# Altium project POWER_PCB.PrjPcb
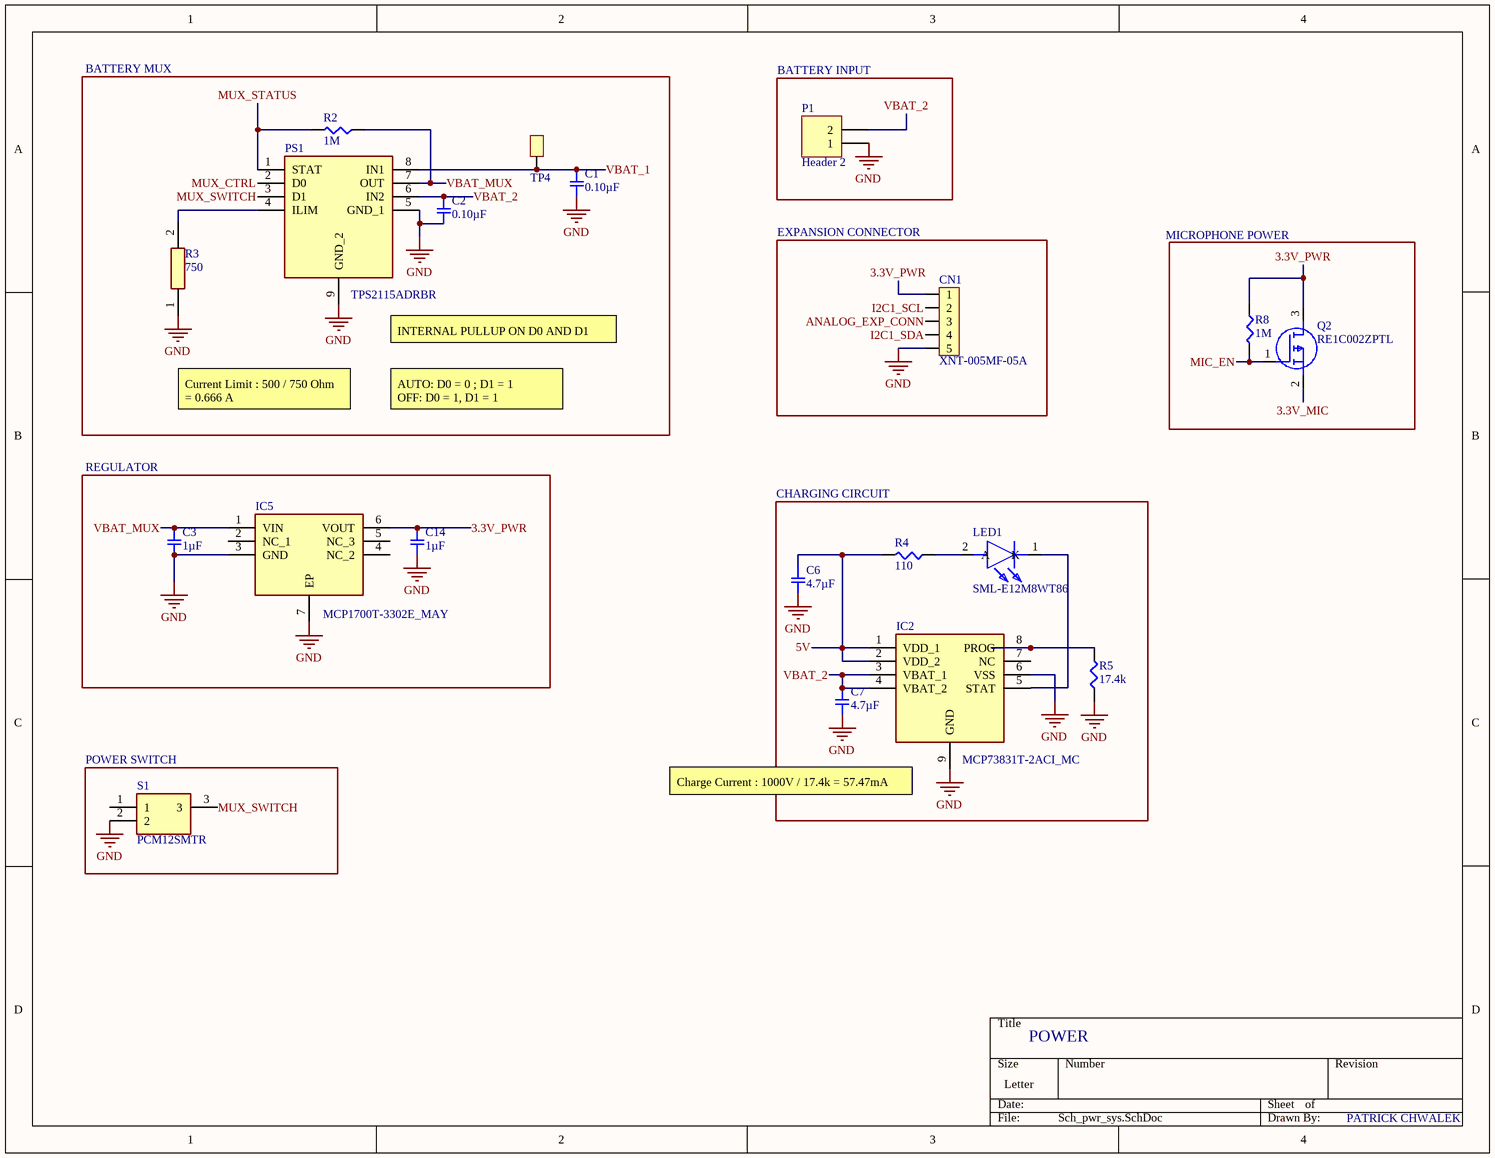
[diagram p0: Sch_pwr_sys.SchDoc]
3 sheets, 88 parts. Net scope: global (net labels, ports and power ports of the same name join across sheets).
Board file: POWER_PCB_v2.PcbDoc
Sheets:
  Sch_pwr_sys.SchDoc
  sch_sensors.SchDoc
  Sch_MCU.SchDoc

## Sheet Sch_pwr_sys.SchDoc
size Letter

### Parts
C1  0.10µF  [SMD-0402C]
C2  0.10µF  [SMD-0402C]
C3  1µF  [SMD-0402C]
C6  4.7µF  [SMD-0402C]
C7  4.7µF  [SMD-0402C]
C14  1µF  [SMD-0402C]
CN1  XNT-005MF-05A  [XNT-005MF-05A]
IC2  MCP73831T-2ACI_MC  [SON50P300X200X100-9N-D]
IC5  MCP1700T-3302E_MAY  [SON65P200X200X90-7N]
LED1  SML-E12M8WT86  [LEDC1608X46N]
P1  Header 2  [HDR1X2]
PS1  TPS2115ADRBR  [SON65P300X300X100-9N-D]
Q2  RE1C002ZPTL  [SOTFL50P160X85-3N]
R2  1M  [SMD-0402-RES]
R3  750  [RESC1005X40N]
R4  110  [SMD-0402-RES]
R5  17.4k  [SMD-0402-RES]
R8  1M  [SMD-0402-RES]
S1  PCM12SMTR  [PCM12SMTR_1]
TP4  TestPoint  [TestPoint_0.4mm]  (value not drawn)

### Blocks framed on the sheet
BATTERY MUX: C1 C2 PS1 R2 R3 TP4
BATTERY INPUT: P1
EXPANSION CONNECTOR: CN1
REGULATOR: C3 C14 IC5
CHARGING CIRCUIT: C6 C7 IC2 LED1 R4 R5
POWER SWITCH: S1

### Nets
3.3V_PWR: C14.1 CN1.1 IC5.6(VOUT) Q2.3(D) R8.1
GND: C1.2 C2.2 C3.2 C6.2 C7.2 C14.2 CN1.5 IC2.6(VSS) IC2.9(GND) IC5.3(GND) IC5.7(EP) P1.1 PS1.5(GND_1) PS1.9(GND_2) R3.1 R5.1 S1.2
3.3V_MIC: Q2.2(S)
5V: C6.1 IC2.1(VDD_1) IC2.2(VDD_2) R4.2
ANALOG_EXP_CONN: CN1.3
I2C1_SCL: CN1.2
I2C1_SDA: CN1.4
MIC_EN: Q2.1(G) R8.2
MUX_CTRL: PS1.2(D0)
MUX_STATUS: PS1.1(STAT) R2.2
MUX_SWITCH: PS1.3(D1) S1.3
VBAT_1: C1.1 PS1.8(IN1) TP4.1
VBAT_2: C2.1 C7.1 IC2.3(VBAT_1) IC2.4(VBAT_2) P1.2 PS1.6(IN2)
VBAT_MUX: C3.1 IC5.1(VIN) PS1.7(OUT) R2.1
NetIC2_5: IC2.5(STAT) LED1.1(K)
NetIC2_8: IC2.8(PROG) R5.2
NetLED1_2: LED1.2(A) R4.1
NetPS1_4: PS1.4(ILIM) R3.2

Not connected (* = marked no-connect by the designer): IC2 7(NC); IC5 2(NC_1) 4(NC_2) 5(NC_3); S1 1

### Notes on the sheet
- MICROPHONE POWER
- (near PS1) INTERNAL PULLUP ON D0 AND D1
- Current Limit : 500 / 750 Ohm = 0.666 A
- AUTO: D0 = 0 ; D1 = 1
  OFF: D0 = 1, D1 = 1
- (near IC2) Charge Current : 1000V / 17.4k = 57.47mA
- POWER
- PATRICK CHWALEK

### Library data of the parts
C1 C2 = GCM155R71C104KA55D: CAP CER 0.1UF 16V X7R 0402; Manufacturer: Murata Electronics North America; Factory Stock: 0; Unit Price (USD): 0.1; Minimum Quantity: 1; Tolerance: ±10%; Datasheets: http://www.murata.com/~/media/webrenewal/support/library/catalog/products/capacitor/mlcc/c03e.ashx; Image: //media.digikey.com/Renders/Murata%20Renders/ZRB-SERIES-0402.jpg; Digi-Key Part Number: 490-4759-1-ND; Part Number: GCM155R71C104KA55D; Quantity Available: 734194; @ qty: 0; Packaging: Cut Tape (CT); Series: GCM; Part Status: Active; Value: 0.10µF; Voltage: 16V; Temperature Coefficient: X7R; Operating Temperature: -55°C ~ 125°C; Features: -; Ratings: AEC-Q200; Applications: Automotive; Mounting Type: Surface Mount, MLCC; Package / Case: 0402 (1005 Metric); Size / Dimension: 0.039" L x 0.020" W (1.00mm x 0.50mm); Height - Seated (Max): -; Thickness (Max): 0.022" (0.55mm); Lead Spacing: -; Lead Style: -
C3 C14 = GCM155C71A105KE38D: CAP CER 1UF 10V X7S 0402; Manufacturer: Murata Electronics North America; Factory Stock: 0; Unit Price (USD): 0.12; Minimum Quantity: 1; Tolerance: ±10%; Datasheets: http://www.murata.com/~/media/webrenewal/support/library/catalog/products/capacitor/mlcc/c03e.ashx; Image: //media.digikey.com/Renders/Murata%20Renders/ZRB-SERIES-0402.jpg; Digi-Key Part Number: 490-13409-1-ND; Part Number: GCM155C71A105KE38D; Quantity Available: 7240; @ qty: 0; Packaging: Cut Tape (CT); Series: GCM; Part Status: Active; Value: 1µF; Voltage: 10V; Temperature Coefficient: X7S; Operating Temperature: -55°C ~ 125°C; Features: -; Ratings: AEC-Q200; Applications: Automotive; Mounting Type: Surface Mount, MLCC; Package / Case: 0402 (1005 Metric); Size / Dimension: 0.039" L x 0.020" W (1.00mm x 0.50mm); Height - Seated (Max): -; Thickness (Max): 0.022" (0.55mm); Lead Spacing: -; Lead Style: -
C6 C7 = GRM153R60G475ME15D: CAP CER 4.7UF 4V X5R 0402; Manufacturer: Murata Electronics North America; Factory Stock: 0; Unit Price (USD): 0.27; Minimum Quantity: 1; Tolerance: ±20%; Datasheets: http://psearch.en.murata.com/capacitor/product/GRM153R60G475ME15%23.pdf; Image: //media.digikey.com/Renders/Murata%20Renders/ZRB-SERIES-0402.jpg; Digi-Key Part Number: 490-13231-1-ND; Part Number: GRM153R60G475ME15D; Quantity Available: 9100; @ qty: 0; Packaging: Cut Tape (CT); Series: GRM; Part Status: Active; Value: 4.7µF; Voltage: 4V; Temperature Coefficient: X5R; Operating Temperature: -55°C ~ 85°C; Features: -; Ratings: -; Applications: General Purpose; Mounting Type: Surface Mount, MLCC; Package / Case: 0402 (1005 Metric); Size / Dimension: 0.039" L x 0.020" W (1.00mm x 0.50mm); Height - Seated (Max): -; Thickness (Max): 0.013" (0.33mm); Lead Spacing: -; Lead Style: -
IC2 = MCP73831T-2ACI_MC: Integrated Circuit; Manufacturer_Name: Microchip; Manufacturer_Part_Number: MCP73831T-2ACI/MC; Allied_Number: 70452042; Datasheet Link: http://ww1.microchip.com/downloads/en/DeviceDoc/20001984g.pdf; Height: 1mm; Mouser Part Number: 579-MCP73831T-2ACIMC; Mouser Price/Stock: https://www.mouser.com/Search/Refine.aspx?Keyword=579-MCP73831T-2ACIMC; Allied Price/Stock: https://www.alliedelec.com/microchiptechnologyinc-mcp73831t-2aci-mc/70452042/
IC5 = MCP1700T-3302E_MAY: Integrated Circuit; Manufacturer_Name: Microchip; Manufacturer_Part_Number: MCP1700T-3302E/MAY; Allied_Number: 70567878; Datasheet Link: http://ww1.microchip.com/downloads/en/DeviceDoc/20001826D.pdf; Height: 0.9mm; Mouser Part Number: 579-MCP1700T3302EMAY; Mouser Price/Stock: https://www.mouser.com/Search/Refine.aspx?Keyword=579-MCP1700T3302EMAY; Allied Price/Stock: https://www.alliedelec.com/microchip-technology-inc-mcp1700t-3302e-may/70567878/
LED1 = SML-E12M8WT86: LED; Manufacturer_Name: ROHM Semiconductor; Datasheet Link: https://www.rohm.com/datasheet/SML-E12M8W/sml-e1-e; Height: 0.46mm; Manufacturer_Part_Number: SML-E12M8WT86; Mouser Part Number: 755-SML-E12M8WT86; Mouser Price/Stock: https://www.mouser.com/Search/Refine.aspx?Keyword=755-SML-E12M8WT86; RS Part Number: 6942799; RS Price/Stock: http://uk.rs-online.com/web/p/products/6942799
P1 = Header 2: Header, 2-Pin; LatestRevisionDate: 17-Jul-2002; LatestRevisionNote: Re-released for DXP Platform.; Publisher: Altium Limited
PS1 = TPS2115ADRBR: Power Supply; Manufacturer_Name: Texas Instruments; Datasheet Link: http://www.ti.com/lit/gpn/tps2115a; Height: 1mm; Manufacturer_Part_Number: TPS2115ADRBR; Mouser Part Number: 595-TPS2115ADRBR; Mouser Price/Stock: https://www.mouser.com/Search/Refine.aspx?Keyword=595-TPS2115ADRBR
Q2 = RE1C002ZPTL: MOSFET (P-Channel); Manufacturer_Name: ROHM Semiconductor; Datasheet Link: https://componentsearchengine.com/Datasheets/1/RE1C002ZPTL.pdf; Height: 0.85mm; Manufacturer_Part_Number: RE1C002ZPTL; Mouser Part Number: 755-RE1C002ZPTL; Mouser Price/Stock: https://www.mouser.com/Search/Refine.aspx?Keyword=755-RE1C002ZPTL; RS Part Number: 1486960P; RS Price/Stock: http://uk.rs-online.com/web/p/products/1486960P
R2 R8 = ERJ-2GEJ105X: RES SMD 1M OHM 5% 1/10W 0402; Manufacturer: Panasonic Electronic Components; Factory Stock: 0; Unit Price (USD): 0.00350; @ qty: 1500; Minimum Quantity: 1; Power (Watts): 0.1W, 1/10W; Temperature Coefficient: ±200ppm/°C; Part Number: ERJ-2GEJ105X; Datasheets: http://industrial.panasonic.com/www-cgi/jvcr13pz.cgi?E+PZ+3+AOA0001+ERJ2GEJ105X+7+WW; Image: //media.digikey.com/Photos/Panasonic%20Photos/ERJ-PA2-Series.jpg; Digi-Key Part Number: P1.0MJCT-ND; Quantity Available: 1082572; Packaging: Cut Tape (CT); Series: ERJ; Part Status: Active; Value: 1M; Tolerance: ±5%; Composition: Thick Film; Features: Automotive AEC-Q200; Operating Temperature: -55°C ~ 155°C; Package / Case: 0402 (1005 Metric); Supplier Device Package: 0402; Size / Dimension: 0.039" L x 0.020" W (1.00mm x 0.50mm); Height - Seated (Max): 0.016" (0.40mm); Number of Terminations: 2; Failure Rate: -
R3 = ERJ-2RKF7500X: RES SMD 750 OHM 1% 1/10W 0402; Manufacturer_Name: Panasonic; Allied_Number: 70265602; Datasheet Link: https://industrial.panasonic.com/cdbs/www-data/pdf/RDA0000/AOA0000C86.pdf; Height: 0.4mm; Manufacturer_Part_Number: ERJ-2RKF7500X; Mouser Part Number: 667-ERJ-2RKF7500X; Allied Price/Stock: https://www.alliedelec.com/panasonic-erj-2rkf7500x/70265602/; Value: 750
R4 = ERJ-2RKF8062X: RES SMD 110 OHM 5% 1/10W 0402; Manufacturer: Panasonic Electronic Components; Factory Stock: 0; Unit Price (USD): 0.00496; @ qty: 1500; Minimum Quantity: 1; Power (Watts): 0.1W, 1/10W; Temperature Coefficient: ±100ppm/°C; Part Number: ERJ-2RKF8062X; Datasheets: http://industrial.panasonic.com/www-cgi/jvcr13pz.cgi?E+PZ+3+AOA0002+ERJ2RKF8062X+7+WW; Image: //media.digikey.com/Photos/Panasonic%20Photos/ERJ-PA2-Series.jpg; Digi-Key Part Number: P80.6KLCT-ND; Quantity Available: 91747; Packaging: Cut Tape (CT); Series: ERJ; Part Status: Active; Value: 110; Tolerance: ±5%; Composition: Thick Film; Features: Automotive AEC-Q200; Operating Temperature: -55°C ~ 155°C; Package / Case: 0402 (1005 Metric); Supplier Device Package: 0402; Size / Dimension: 0.039" L x 0.020" W (1.00mm x 0.50mm); Height - Seated (Max): 0.016" (0.40mm); Number of Terminations: 2; Failure Rate: -
R5 = ERJ-2GEJ103X: RES SMD 17.4K OHM 1% 1/10W 0402; Manufacturer: Panasonic Electronic Components; Factory Stock: 0; Unit Price (USD): 0.00350; @ qty: 1500; Minimum Quantity: 1; Power (Watts): 0.1W, 1/10W; Temperature Coefficient: ±200ppm/°C; Part Number: ERJ-2GEJ103X; Datasheets: http://industrial.panasonic.com/www-cgi/jvcr13pz.cgi?E+PZ+3+AOA0001+ERJ2GEJ103X+7+WW; Image: //media.digikey.com/Photos/Panasonic%20Photos/ERJ-PA2-Series.jpg; Digi-Key Part Number: P10KJCT-ND; Quantity Available: 2560215; Packaging: Cut Tape (CT); Series: ERJ; Part Status: Active; Value: 17.4k; Tolerance: ±1%; Composition: Thick Film; Features: Automotive AEC-Q200; Operating Temperature: -55°C ~ 155°C; Package / Case: 0402 (1005 Metric); Supplier Device Package: 0402; Size / Dimension: 0.039" L x 0.020" W (1.00mm x 0.50mm); Height - Seated (Max): 0.016" (0.40mm); Number of Terminations: 2; Failure Rate: -
S1 = PCM12SMTR: Switch; Manufacturer_Name: C & K COMPONENTS; Allied_Number: 70417448; Datasheet Link: http://www.farnell.com/datasheets/1789487.pdf; Manufacturer_Part_Number: PCM12SMTR; Mouser Part Number: 611-PCM12SMTR; Mouser Price/Stock: https://www.mouser.com/Search/Refine.aspx?Keyword=611-PCM12SMTR; RS Part Number: 7931721P; RS Price/Stock: http://uk.rs-online.com/web/p/products/7931721P; Allied Price/Stock: https://www.alliedelec.com/c-k-pcm12smtr/70417448/

## Sheet sch_sensors.SchDoc
size Letter
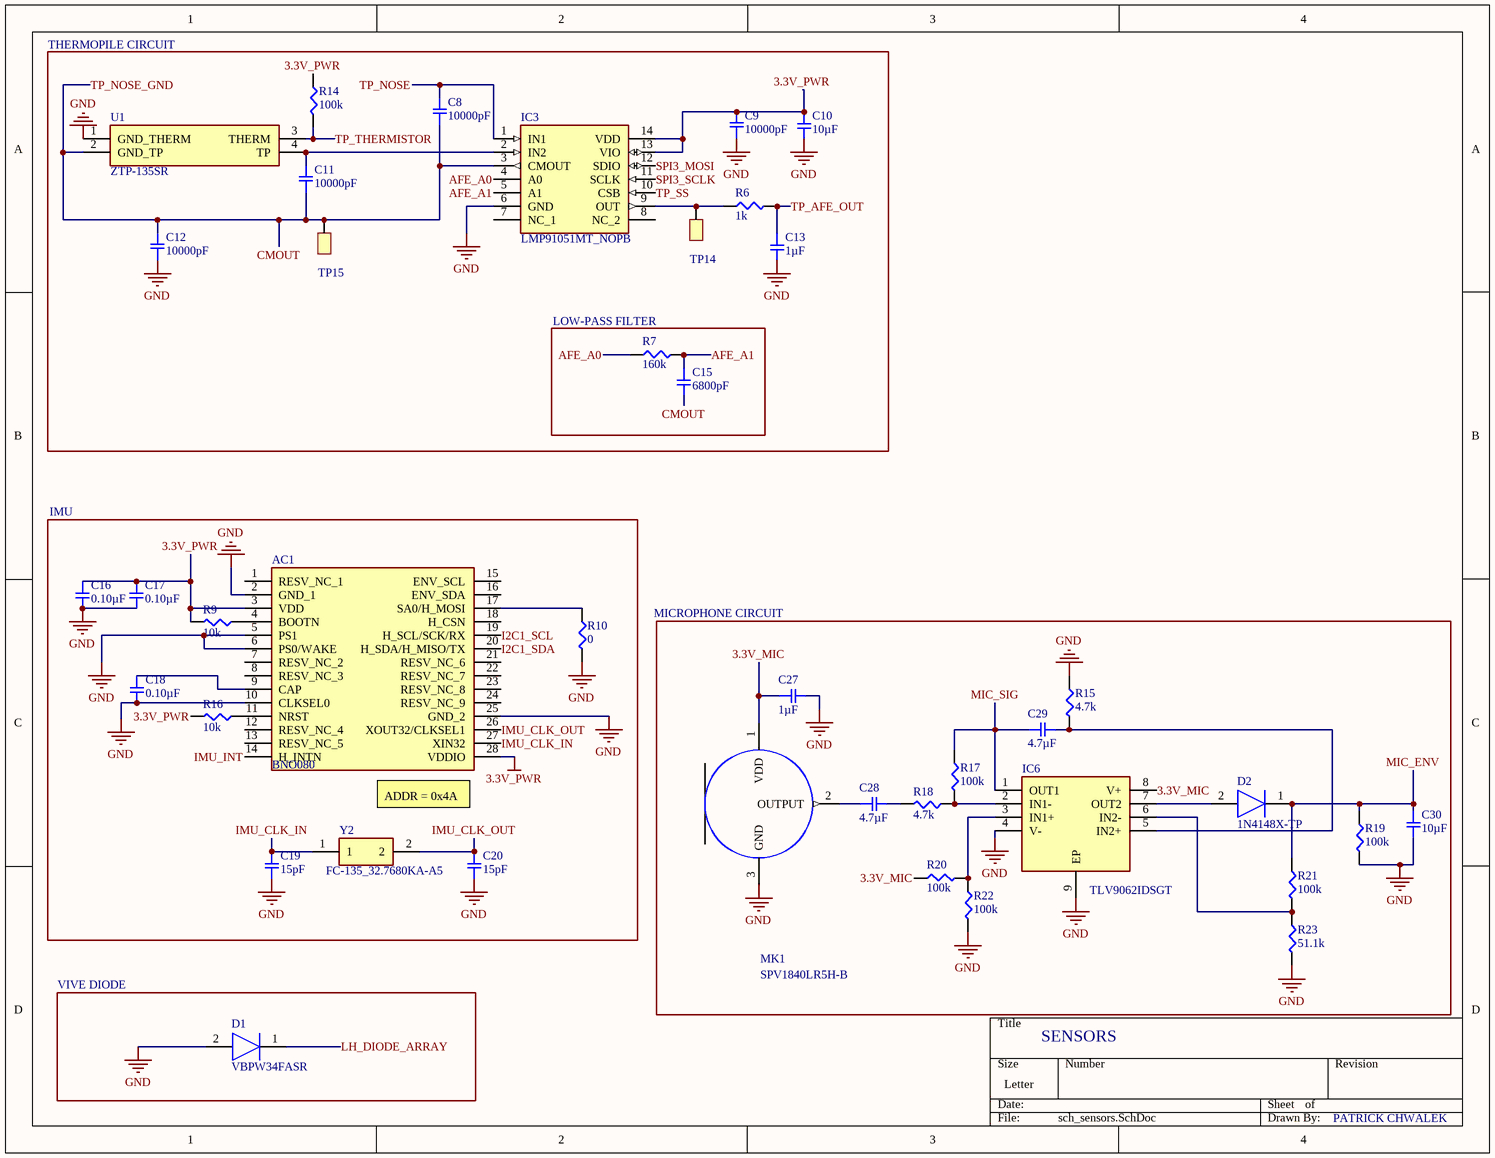
[diagram p1: sch_sensors.SchDoc]

### Parts
AC1  BNO080  [BNO080]
C8  10000pF  [SMD-0402C]
C9  10000pF  [SMD-0402C]
C10  10µF  [SMD-0402C]
C11  10000pF  [SMD-0402C]
C12  10000pF  [SMD-0402C]
C13  1µF  [SMD-0402C]
C15  6800pF  [SMD-0402C]
C16  0.10µF  [CAPC1005X55N]
C17  0.10µF  [CAPC1005X55N]
C18  0.10µF  [CAPC1005X55N]
C19  15pF  [CAPC1005X55N]
C20  15pF  [CAPC1005X55N]
C27  1µF  [SMD-0402-RES]
C28  4.7µF  [SMD-0402C]
C29  4.7µF  [SMD-0402C]
C30  10µF  [SMD-0402C]
D1  VBPW34FASR  [VBPW34FASR]
D2  1N4148X-TP  [SODFL1608X70N]
IC3  LMP91051MT_NOPB  [SOP65P640X120-14N]
IC6  TLV9062IDSGT  [SON50P200X200X80-9N]
MK1  SPV1840LR5H-B  [*MIC_SPV1840LR5H-B]
R6  1k  [SMD-0402-RES]
R7  160k  [SMD-0402-RES]
R9  10k  [SMD-0402-RES]
R10  0  [SMD-0402-RES]
R14  100k  [SMD-0402-RES]
R15  4.7k  [SMD-0402-RES]
R16  10k  [SMD-0402-RES]
R17  100k  [SMD-0402-RES]
R18  4.7k  [SMD-0402-RES]
R19  100k  [SMD-0402-RES]
R20  100k  [SMD-0402-RES]
R21  100k  [SMD-0402-RES]
R22  100k  [SMD-0402-RES]
R23  51.1k  [SMD-0402-RES]
TP14  TestPoint  [TestPoint_0.4mm]  (value not drawn)
TP15  TestPoint  [TestPoint_0.4mm]  (value not drawn)
U1  ZTP-135SR  [ZTP-135SR]
Y2  FC-135_32.7680KA-A5  [FC135327680KAAG0]

### Blocks framed on the sheet
THERMOPILE CIRCUIT: C8-C13 IC3 R6 R14 TP14 TP15 U1
LOW-PASS FILTER: C15 R7
IMU: AC1 C16-C20 R9 R10 R16 Y2
VIVE DIODE: D1

### Nets
3.3V_PWR: AC1.3(VDD) AC1.28(VDDIO) C9.2 C10.1 C16.1 C17.1 IC3.13(VIO) IC3.14(VDD) R9.2 R14.1 R16.2
GND: AC1.2(GND_1) AC1.5(PS1) AC1.6(PS0/WAKE) AC1.10(CLKSEL0) AC1.25(GND_2) C9.1 C10.2 C12.1 C13.2 C16.2 C17.2 C18.2 C19.2 C20.2 C27.2 C30.2 D1.2(K) IC3.6(GND) IC6.4(V-) IC6.9(EP) MK1.3(GND) R10.2 R15.1 R19.2 R22.2 R23.2 U1.1(GND_THERM)
3.3V_MIC: C27.1 IC6.8(V+) MK1.1(VDD) R20.1
AFE_A0: IC3.4(A0) R7.1
AFE_A1: C15.1 IC3.5(A1) R7.2
CMOUT: C8.1 C11.1 C12.2 C15.2 IC3.3(CMOUT) TP15.1 U1.2(GND_TP)  [also labelled TP_NOSE_GND]
I2C1_SCL: AC1.19(H_SCL/SCK/RX)
I2C1_SDA: AC1.20(H_SDA/H_MISO/TX)
IMU_CLK_IN: AC1.27(XIN32) C19.1 Y2.1
IMU_CLK_OUT: AC1.26(XOUT32/CLKSEL1) C20.1 Y2.2
IMU_INT: AC1.14(H_INTN)
LH_DIODE_ARRAY: D1.1(A)
MIC_ENV: C30.1 D2.1(K) R19.1 R21.1
MIC_SIG: C29.1 IC6.1(OUT1) R17.1
SPI3_MOSI: IC3.12(SDIO)
SPI3_SCLK: IC3.11(SCLK)
TP_AFE_OUT: C13.1 R6.2
TP_NOSE: C8.2 IC3.1(IN1)
TP_SS: IC3.10(CSB)
TP_THERMISTOR: R14.2 U1.3(THERM)
NetAC1_4: AC1.4(BOOTN) R9.1
NetAC1_9: AC1.9(CAP) C18.1
NetAC1_11: AC1.11(NRST) R16.1
NetAC1_17: AC1.17(SA0/H_MOSI) R10.1
NetC11_2: C11.2 IC3.2(IN2) U1.4(TP)
NetC28_1: C28.1 MK1.2(OUTPUT)
NetC28_2: C28.2 R18.2
NetC29_2: C29.2 IC6.5(IN2+) R15.2
NetD2_2: D2.2(A) IC6.7(OUT2)
NetIC3_9: IC3.9(OUT) R6.1 TP14.1
NetIC6_2: IC6.2(IN1-) R17.2 R18.1
NetIC6_3: IC6.3(IN1+) R20.2 R22.1
NetIC6_6: IC6.6(IN2-) R21.2 R23.1

Not connected (* = marked no-connect by the designer): AC1 1(RESV_NC_1) 7(RESV_NC_2) 8(RESV_NC_3) 12(RESV_NC_4) 13(RESV_NC_5) 15(ENV_SCL) 16(ENV_SDA) 18(H_CSN) 21(RESV_NC_6) 22(RESV_NC_7) 23(RESV_NC_8) 24(RESV_NC_9); IC3 7(NC_1) 8(NC_2)

### Notes on the sheet
- MICROPHONE CIRCUIT
- (near AC1) ADDR = 0x4A
- SENSORS
- PATRICK CHWALEK

### Library data of the parts
AC1 = BNO080: Accelerometer; Manufacturer_Name: Hillcrest Laboratories; Datasheet Link: http://www.hillcrestlabs.com/download/5a05f340566d07c196001ec1; Height: 1.18mm; Manufacturer_Part_Number: BNO080
C8 C9 C11 C12 = GCM155R71H103KA55D: CAP CER 10000PF 50V X7R 0402; Manufacturer: Murata Electronics North America; Factory Stock: 0; Unit Price (USD): 0.1; Minimum Quantity: 1; Tolerance: ±10%; Datasheets: http://www.murata.com/~/media/webrenewal/support/library/catalog/products/capacitor/mlcc/c03e.ashx; Image: //media.digikey.com/Renders/Murata%20Renders/ZRB-SERIES-0402.jpg; Digi-Key Part Number: 490-4762-1-ND; Part Number: GCM155R71H103KA55D; Quantity Available: 650067; @ qty: 0; Packaging: Cut Tape (CT); Series: GCM; Part Status: Active; Value: 10000pF; Voltage: 50V; Temperature Coefficient: X7R; Operating Temperature: -55°C ~ 125°C; Features: -; Ratings: AEC-Q200; Applications: Automotive; Mounting Type: Surface Mount, MLCC; Package / Case: 0402 (1005 Metric); Size / Dimension: 0.039" L x 0.020" W (1.00mm x 0.50mm); Height - Seated (Max): -; Thickness (Max): 0.022" (0.55mm); Lead Spacing: -; Lead Style: -
C10 C30 = GRJ155R60J106ME11D: CAP CER 10UF 6.3V X5R 0402; Manufacturer: Murata Electronics North America; Factory Stock: 0; Unit Price (USD): 0.23; Minimum Quantity: 1; Tolerance: ±20%; Datasheets: http://psearch.en.murata.com/capacitor/product/GRJ155R60J106ME11%23.pdf; Image: //media.digikey.com/Renders/Murata%20Renders/ZRB-SERIES-0402.jpg; Digi-Key Part Number: 490-13211-1-ND; Part Number: GRJ155R60J106ME11D; Quantity Available: 64064; @ qty: 0; Packaging: Cut Tape (CT); Series: GRJ; Part Status: Active; Value: 10µF; Voltage: 6.3V; Temperature Coefficient: X5R; Operating Temperature: -55°C ~ 85°C; Features: Derating Recommended, Soft Termination; Ratings: -; Applications: Boardflex Sensitive; Mounting Type: Surface Mount, MLCC; Package / Case: 0402 (1005 Metric); Size / Dimension: 0.039" L x 0.020" W (1.00mm x 0.50mm); Height - Seated (Max): -; Thickness (Max): 0.028" (0.70mm); Lead Spacing: -; Lead Style: -
C13 C27 = GCM155C71A105KE38D: as C3 on sheet Sch_pwr_sys; Datasheets: http://www.murata.com/~/media/webrenewal/support/library/catalog/products/capacitor/mlcc/c03e.ashx; Image: //media.digikey.com/Renders/Murata%20Renders/ZRB-SERIES-0402.jpg; Digi-Key Part Number: 490-13409-1-ND; Part Number: GCM155C71A105KE38D; Quantity Available: 7240; @ qty: 0; Packaging: Cut Tape (CT); Series: GCM; Part Status: Active; Value: 1µF; Voltage: 10V; Temperature Coefficient: X7S; Operating Temperature: -55°C ~ 125°C; Features: -; Ratings: AEC-Q200; Applications: Automotive; Mounting Type: Surface Mount, MLCC; Package / Case: 0402 (1005 Metric); Size / Dimension: 0.039" L x 0.020" W (1.00mm x 0.50mm); Height - Seated (Max): -; Thickness (Max): 0.022" (0.55mm); Lead Spacing: -; Lead Style: -
C15 = GRM155R71E682KA01J: CAP CER 6800PF 25V X7R 0402; Manufacturer: Murata Electronics North America; Factory Stock: 0; Unit Price (USD): 0.1; Minimum Quantity: 1; Tolerance: ±10%; Datasheets: http://www.murata.com/~/media/webrenewal/support/library/catalog/products/capacitor/mlcc/c02e.pdf; Image: //media.digikey.com/Renders/Murata%20Renders/ZRB-SERIES-0402.jpg; Digi-Key Part Number: 490-11422-1-ND; Part Number: GRM155R71E682KA01J; Quantity Available: 44380; @ qty: 0; Packaging: Cut Tape (CT); Series: GRM; Part Status: Active; Value: 6800pF; Voltage: 25V; Temperature Coefficient: X7R; Operating Temperature: -55°C ~ 125°C; Features: -; Ratings: -; Applications: General Purpose; Mounting Type: Surface Mount, MLCC; Package / Case: 0402 (1005 Metric); Size / Dimension: 0.039" L x 0.020" W (1.00mm x 0.50mm); Height - Seated (Max): -; Thickness (Max): 0.022" (0.55mm); Lead Spacing: -; Lead Style: -
C16-C18 = GCM155R71C104KA55D: as C1 on sheet Sch_pwr_sys; Datasheets: http://www.murata.com/~/media/webrenewal/support/library/catalog/products/capacitor/mlcc/c03e.ashx; Image: //media.digikey.com/Renders/Murata%20Renders/ZRB-SERIES-0402.jpg; Digi-Key Part Number: 490-4759-1-ND; Part Number: GCM155R71C104KA55D; Quantity Available: 734194; @ qty: 0; Packaging: Cut Tape (CT); Series: GCM; Part Status: Active; Value: 0.10µF; Voltage: 16V; Temperature Coefficient: X7R; Operating Temperature: -55°C ~ 125°C; Features: -; Ratings: AEC-Q200; Applications: Automotive; Mounting Type: Surface Mount, MLCC; Package / Case: 0402 (1005 Metric); Size / Dimension: 0.039" L x 0.020" W (1.00mm x 0.50mm); Height - Seated (Max): -; Thickness (Max): 0.022" (0.55mm); Lead Spacing: -; Lead Style: -
C19 C20 = GCM1555C1H150JA16D: CAP CER 15PF 50V NP0 0402; Manufacturer: Murata Electronics North America; Factory Stock: 0; Unit Price (USD): 0.1; Minimum Quantity: 1; Tolerance: ±5%; Temperature Coefficient: C0G, NP0; Datasheets: http://www.murata.com/~/media/webrenewal/support/library/catalog/products/capacitor/mlcc/c03e.ashx; Image: //media.digikey.com/Renders/Murata%20Renders/ZRB-SERIES-0402.jpg; Digi-Key Part Number: 490-11147-1-ND; Part Number: GCM1555C1H150JA16D; Quantity Available: 6185; @ qty: 0; Packaging: Cut Tape (CT); Series: GCM; Part Status: Active; Value: 15pF; Voltage: 50V; Operating Temperature: -55°C ~ 125°C; Features: -; Ratings: AEC-Q200; Applications: Automotive; Mounting Type: Surface Mount, MLCC; Package / Case: 0402 (1005 Metric); Size / Dimension: 0.039" L x 0.020" W (1.00mm x 0.50mm); Height - Seated (Max): -; Thickness (Max): 0.022" (0.55mm); Lead Spacing: -; Lead Style: -
C28 C29 = GRM153R60G475ME15D: as C6 on sheet Sch_pwr_sys; Datasheets: http://psearch.en.murata.com/capacitor/product/GRM153R60G475ME15%23.pdf; Image: //media.digikey.com/Renders/Murata%20Renders/ZRB-SERIES-0402.jpg; Digi-Key Part Number: 490-13231-1-ND; Part Number: GRM153R60G475ME15D; Quantity Available: 9100; @ qty: 0; Packaging: Cut Tape (CT); Series: GRM; Part Status: Active; Value: 4.7µF; Voltage: 4V; Temperature Coefficient: X5R; Operating Temperature: -55°C ~ 85°C; Features: -; Ratings: -; Applications: General Purpose; Mounting Type: Surface Mount, MLCC; Package / Case: 0402 (1005 Metric); Size / Dimension: 0.039" L x 0.020" W (1.00mm x 0.50mm); Height - Seated (Max): -; Thickness (Max): 0.013" (0.33mm); Lead Spacing: -; Lead Style: -
D1 = VBPW34FASR: Diode; Manufacturer_Name: Vishay; Datasheet Link: https://www.vishay.com/docs/81127/vbpw34fa.pdf; Height: 1.3mm; Manufacturer_Part_Number: VBPW34FASR; Mouser Part Number: 782-VBPW34FASR; Mouser Price/Stock: https://www.mouser.com/Search/Refine.aspx?Keyword=782-VBPW34FASR; RS Part Number: 7689401; RS Price/Stock: https://uk.rs-online.com/web/p/products/7689401
D2 = 1N4148X-TP: Diode; Manufacturer_Name: Micro Commercial Components (MCC); Datasheet Link: http://www.mouser.com/ds/2/258/1N4148X(SOD-523)-349105.pdf; Height: 0.7mm; Manufacturer_Part_Number: 1N4148X-TP; Mouser Part Number: 833-1N4148X-TP; Mouser Price/Stock: https://www.mouser.com/Search/Refine.aspx?Keyword=833-1N4148X-TP
IC3 = LMP91051MT_NOPB: Integrated Circuit; Manufacturer_Name: Texas Instruments; Manufacturer_Part_Number: LMP91051MT/NOPB; Datasheet Link: http://www.ti.com/lit/ds/symlink/lmp91051.pdf; Height: 1.2mm; Mouser Part Number: 595-LMP91051MT/NOPB; Mouser Price/Stock: https://www.mouser.com/Search/Refine.aspx?Keyword=595-LMP91051MT%2FNOPB
IC6 = TLV9062IDSGT: Integrated Circuit; Manufacturer_Name: Texas Instruments; Datasheet Link: http://www.ti.com/lit/gpn/TLV9062; Height: 0.8mm; Manufacturer_Part_Number: TLV9062IDSGT; Mouser Part Number: 595-TLV9062IDSGT; Mouser Price/Stock: https://www.mouser.com/Search/Refine.aspx?Keyword=595-TLV9062IDSGT
MK1 = SPV1840LR5H-B: Mic Mems Analog; MF: Knowles; MP: SPV1840LR5H-B; Package: 0805 Knowles; SnapEDA_Link: https://www.snapeda.com/parts/SPV1840LR5H-B/Knowles/view-part/?ref=snap; Availability: Unavailable; Price: None; Value: *
R6 = ERJ-2GEJ102X: RES SMD 1K OHM 5% 1/10W 0402; Manufacturer: Panasonic Electronic Components; Factory Stock: 0; Unit Price (USD): 0.00350; @ qty: 1500; Minimum Quantity: 1; Power (Watts): 0.1W, 1/10W; Temperature Coefficient: ±200ppm/°C; Part Number: ERJ-2GEJ102X; Datasheets: http://industrial.panasonic.com/www-cgi/jvcr13pz.cgi?E+PZ+3+AOA0001+ERJ2GEJ102X+7+WW; Image: //media.digikey.com/Photos/Panasonic%20Photos/ERJ-PA2-Series.jpg; Digi-Key Part Number: P1.0KJCT-ND; Quantity Available: 1939857; Packaging: Cut Tape (CT); Series: ERJ; Part Status: Active; Value: 1k; Tolerance: ±5%; Composition: Thick Film; Features: Automotive AEC-Q200; Operating Temperature: -55°C ~ 155°C; Package / Case: 0402 (1005 Metric); Supplier Device Package: 0402; Size / Dimension: 0.039" L x 0.020" W (1.00mm x 0.50mm); Height - Seated (Max): 0.016" (0.40mm); Number of Terminations: 2; Failure Rate: -
R7 = ERJ-2GEJ164X: RES SMD 160K OHM 5% 1/10W 0402; Manufacturer: Panasonic Electronic Components; Factory Stock: 0; Unit Price (USD): 0.00350; @ qty: 1500; Minimum Quantity: 1; Power (Watts): 0.1W, 1/10W; Temperature Coefficient: ±200ppm/°C; Part Number: ERJ-2GEJ164X; Datasheets: http://industrial.panasonic.com/www-cgi/jvcr13pz.cgi?E+PZ+3+AOA0001+ERJ2GEJ164X+7+WW; Image: //media.digikey.com/Photos/Panasonic%20Photos/ERJ-PA2-Series.jpg; Digi-Key Part Number: P160KJCT-ND; Quantity Available: 64191; Packaging: Cut Tape (CT); Series: ERJ; Part Status: Active; Value: 160k; Tolerance: ±5%; Composition: Thick Film; Features: Automotive AEC-Q200; Operating Temperature: -55°C ~ 155°C; Package / Case: 0402 (1005 Metric); Supplier Device Package: 0402; Size / Dimension: 0.039" L x 0.020" W (1.00mm x 0.50mm); Height - Seated (Max): 0.016" (0.40mm); Number of Terminations: 2; Failure Rate: -
R9 R16 = ERJ-2GEJ103X: RES SMD 10K OHM 5% 1/10W 0402; Manufacturer: Panasonic Electronic Components; Factory Stock: 0; Unit Price (USD): 0.00350; @ qty: 1500; Minimum Quantity: 1; Power (Watts): 0.1W, 1/10W; Temperature Coefficient: ±200ppm/°C; Part Number: ERJ-2GEJ103X; Datasheets: http://industrial.panasonic.com/www-cgi/jvcr13pz.cgi?E+PZ+3+AOA0001+ERJ2GEJ103X+7+WW; Image: //media.digikey.com/Photos/Panasonic%20Photos/ERJ-PA2-Series.jpg; Digi-Key Part Number: P10KJCT-ND; Quantity Available: 2560215; Packaging: Cut Tape (CT); Series: ERJ; Part Status: Active; Value: 10k; Tolerance: ±5%; Composition: Thick Film; Features: Automotive AEC-Q200; Operating Temperature: -55°C ~ 155°C; Package / Case: 0402 (1005 Metric); Supplier Device Package: 0402; Size / Dimension: 0.039" L x 0.020" W (1.00mm x 0.50mm); Height - Seated (Max): 0.016" (0.40mm); Number of Terminations: 2; Failure Rate: -
R10 = ERJ-2GEJ103X: RES SMD 0K OHM 5% 1/10W 0402; Manufacturer: Panasonic Electronic Components; Unit Price (USD): 0.00350; @ qty: 1500; Minimum Quantity: 1; Power (Watts): 0.1W, 1/10W; Temperature Coefficient: ±200ppm/°C; Part Number: ERJ-2GEJ103X; Datasheets: http://industrial.panasonic.com/www-cgi/jvcr13pz.cgi?E+PZ+3+AOA0001+ERJ2GEJ103X+7+WW; Image: //media.digikey.com/Photos/Panasonic%20Photos/ERJ-PA2-Series.jpg; Digi-Key Part Number: P10KJCT-ND; Quantity Available: 2560215; Factory Stock: 0; Packaging: Cut Tape (CT); Series: ERJ; Part Status: Active; Value: 0; Tolerance: ±5%; Composition: Thick Film; Features: Automotive AEC-Q200; Operating Temperature: -55°C ~ 155°C; Package / Case: 0402 (1005 Metric); Supplier Device Package: 0402; Size / Dimension: 0.039" L x 0.020" W (1.00mm x 0.50mm); Height - Seated (Max): 0.016" (0.40mm); Number of Terminations: 2; Failure Rate: -
R14 R17 R19-R22 = ERJ-2GEJ103X: RES SMD 100K OHM 5% 1/10W 0402; Manufacturer: Panasonic Electronic Components; Factory Stock: 0; Unit Price (USD): 0.00350; @ qty: 1500; Minimum Quantity: 1; Power (Watts): 0.1W, 1/10W; Temperature Coefficient: ±200ppm/°C; Part Number: ERJ-2GEJ103X; Datasheets: http://industrial.panasonic.com/www-cgi/jvcr13pz.cgi?E+PZ+3+AOA0001+ERJ2GEJ103X+7+WW; Image: //media.digikey.com/Photos/Panasonic%20Photos/ERJ-PA2-Series.jpg; Digi-Key Part Number: P10KJCT-ND; Quantity Available: 2560215; Packaging: Cut Tape (CT); Series: ERJ; Part Status: Active; Value: 100k; Tolerance: ±5%; Composition: Thick Film; Features: Automotive AEC-Q200; Operating Temperature: -55°C ~ 155°C; Package / Case: 0402 (1005 Metric); Supplier Device Package: 0402; Size / Dimension: 0.039" L x 0.020" W (1.00mm x 0.50mm); Height - Seated (Max): 0.016" (0.40mm); Number of Terminations: 2; Failure Rate: -
R15 R18 = ERJ-2GEJ103X: RES SMD 4.7K OHM 5% 1/10W 0402; Manufacturer: Panasonic Electronic Components; Factory Stock: 0; Unit Price (USD): 0.00350; @ qty: 1500; Minimum Quantity: 1; Power (Watts): 0.1W, 1/10W; Temperature Coefficient: ±200ppm/°C; Part Number: ERJ-2GEJ103X; Datasheets: http://industrial.panasonic.com/www-cgi/jvcr13pz.cgi?E+PZ+3+AOA0001+ERJ2GEJ103X+7+WW; Image: //media.digikey.com/Photos/Panasonic%20Photos/ERJ-PA2-Series.jpg; Digi-Key Part Number: P10KJCT-ND; Quantity Available: 2560215; Packaging: Cut Tape (CT); Series: ERJ; Part Status: Active; Value: 4.7k; Tolerance: ±5%; Composition: Thick Film; Features: Automotive AEC-Q200; Operating Temperature: -55°C ~ 155°C; Package / Case: 0402 (1005 Metric); Supplier Device Package: 0402; Size / Dimension: 0.039" L x 0.020" W (1.00mm x 0.50mm); Height - Seated (Max): 0.016" (0.40mm); Number of Terminations: 2; Failure Rate: -
R23 = ERJ-2GEJ103X: RES SMD 51.1K OHM 5% 1/10W 0402; Manufacturer: Panasonic Electronic Components; Factory Stock: 0; Unit Price (USD): 0.00350; @ qty: 1500; Minimum Quantity: 1; Power (Watts): 0.1W, 1/10W; Temperature Coefficient: ±200ppm/°C; Part Number: ERJ-2GEJ103X; Datasheets: http://industrial.panasonic.com/www-cgi/jvcr13pz.cgi?E+PZ+3+AOA0001+ERJ2GEJ103X+7+WW; Image: //media.digikey.com/Photos/Panasonic%20Photos/ERJ-PA2-Series.jpg; Digi-Key Part Number: P10KJCT-ND; Quantity Available: 2560215; Packaging: Cut Tape (CT); Series: ERJ; Part Status: Active; Value: 51.1k; Tolerance: ±5%; Composition: Thick Film; Features: Automotive AEC-Q200; Operating Temperature: -55°C ~ 155°C; Package / Case: 0402 (1005 Metric); Supplier Device Package: 0402; Size / Dimension: 0.039" L x 0.020" W (1.00mm x 0.50mm); Height - Seated (Max): 0.016" (0.40mm); Number of Terminations: 2; Failure Rate: -
U1 = ZTP-135SR: Undefined or Miscellaneous; Manufacturer_Name: Amphenol Advanced Sensors; Allied_Number: 70282698; Datasheet Link: https://www.amphenol-sensors.com/en/component/edocman/370-thermopile-ir-sensor-applications/download?Itemid=7967; Manufacturer_Part_Number: ZTP-135SR; Mouser Part Number: 527-ZTP-135SR; Mouser Price/Stock: https://www.mouser.com/Search/Refine.aspx?Keyword=527-ZTP-135SR; Allied Price/Stock: https://www.alliedelec.com/amphenol-advanced-sensors-ztp-135sr/70282698/
Y2 = FC-135_32.7680KA-A3: Crystal or Oscillator; Manufacturer_Name: Epson Timing; Manufacturer_Part_Number: FC-135 32.7680KA-A5; Datasheet Link: https://support.epson.biz/td/api/doc_check.php?dl=brief_fc-135r_en.pdf; Height: 0mm; Mouser Part Number: 732-FC135-32.76KAA3; Mouser Price/Stock: https://www.mouser.com/Search/Refine.aspx?Keyword=732-FC135-32.76KAA3

## Sheet Sch_MCU.SchDoc
size A
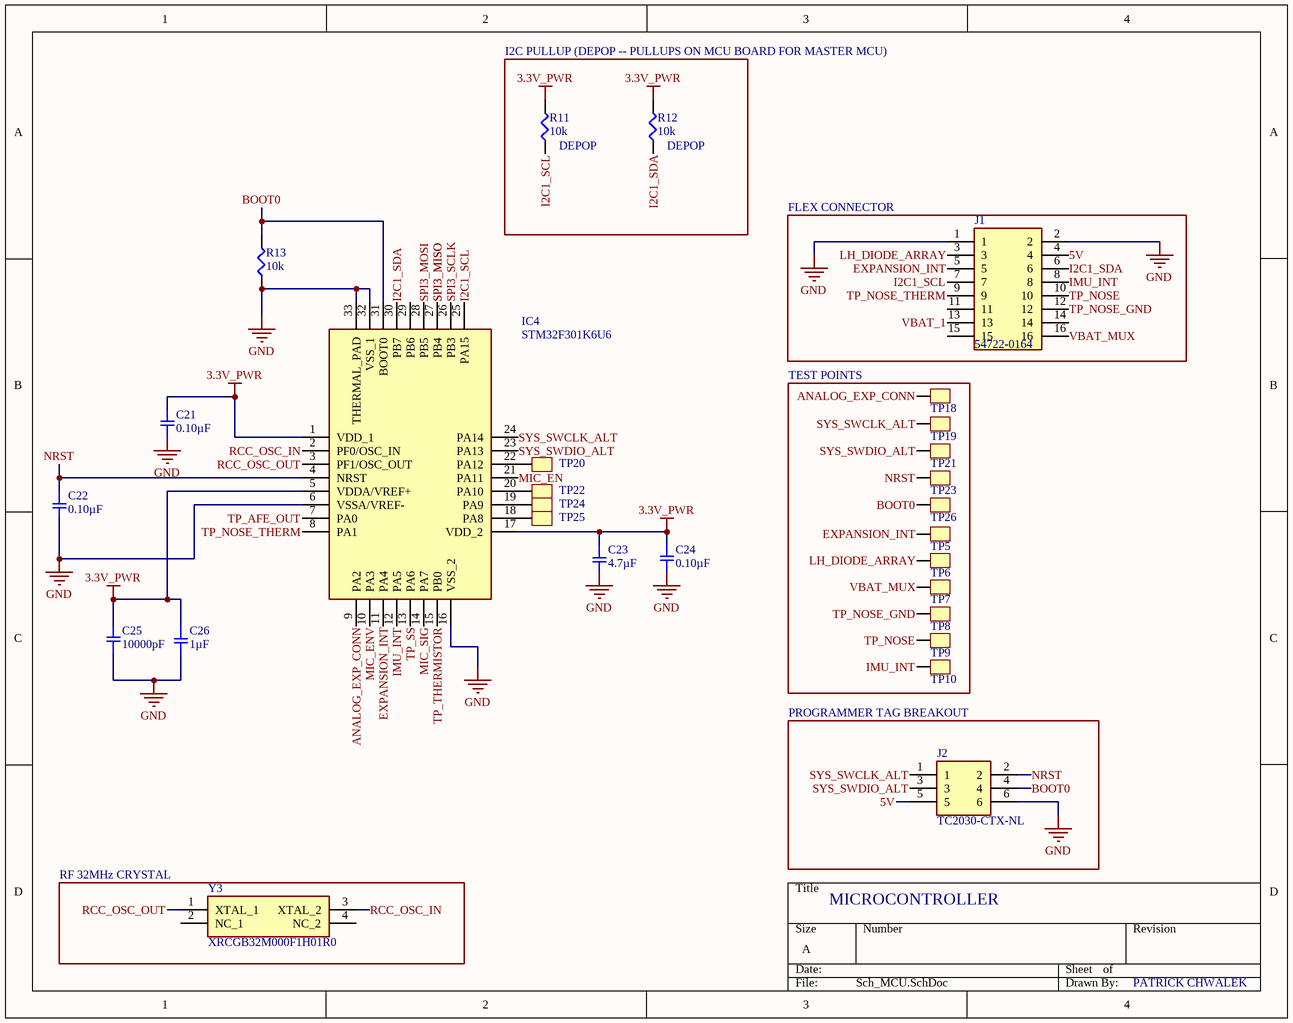
[diagram p2: Sch_MCU.SchDoc]

### Parts
C21  0.10µF  [SMD-0402C]
C22  0.10µF  [SMD-0402C]
C23  4.7µF  [SMD-0402C]
C24  0.10µF  [SMD-0402C]
C25  10000pF  [SMD-0402C]
C26  1µF  [SMD-0402C]
IC4  STM32F301K6U6  [QFN50P500X500X60-33N-D]
J1  54722-0164  [54722-0164]
J2  TC2030-CTX-NL  [TC2030MCPNL10]
R11  10k  [SMD-0402-RES]
R12  10k  [SMD-0402-RES]
R13  10k  [SMD-0402-RES]
TP5  TestPoint  [TestPoint_0.4mm]  (value not drawn)
TP6  TestPoint  [TestPoint_0.4mm]  (value not drawn)
TP7  TestPoint  [TestPoint_0.4mm]  (value not drawn)
TP8  TestPoint  [TestPoint_0.4mm]  (value not drawn)
TP9  TestPoint  [TestPoint_0.4mm]  (value not drawn)
TP10  TestPoint  [TestPoint_0.4mm]  (value not drawn)
TP18  TestPoint  [TestPoint_0.4mm]  (value not drawn)
TP19  TestPoint  [TestPoint_0.4mm]  (value not drawn)
TP20  TestPoint  [TESTPOINT_1MM_OVAL]  (value not drawn)
TP21  TestPoint  [TestPoint_0.4mm]  (value not drawn)
TP22  TestPoint  [TESTPOINT_1MM_OVAL]  (value not drawn)
TP23  TestPoint  [TestPoint_0.4mm]  (value not drawn)
TP24  TestPoint  [TESTPOINT_1MM_OVAL]  (value not drawn)
TP25  TestPoint  [TESTPOINT_1MM_OVAL]  (value not drawn)
TP26  TestPoint  [TestPoint_0.4mm]  (value not drawn)
Y3  XRCGB32M000F1H01R0  [XRCGB32M000F1H01R0]

### Blocks framed on the sheet
FLEX CONNECTOR: J1
TEST POINTS: TP5-TP10 TP18 TP19 TP21 TP23 TP26
PROGRAMMER TAG BREAKOUT: J2
RF 32MHz CRYSTAL: Y3

### Nets
3.3V_PWR: C21.2 C23.1 C24.2 C25.2 C26.1 IC4.1(VDD_1) IC4.5(VDDA/VREF+) IC4.17(VDD_2) R11.2 R12.2
GND: C21.1 C22.2 C23.2 C24.1 C25.1 C26.2 IC4.6(VSSA/VREF-) IC4.16(VSS_2) IC4.32(VSS_1) IC4.33(THERMAL_PAD) J1.1 J1.2 J2.6 R13.1
5V: J1.4 J2.5
ANALOG_EXP_CONN: IC4.9(PA2) TP18.1
BOOT0: IC4.31(BOOT0) J2.4 R13.2 TP26.1
EXPANSION_INT: IC4.11(PA4) J1.5 TP5.1
I2C1_SCL: IC4.25(PA15) J1.7 R11.1
I2C1_SDA: IC4.30(PB7) J1.6 R12.1
IMU_INT: IC4.12(PA5) J1.8 TP10.1
LH_DIODE_ARRAY: J1.3 TP6.1
MIC_EN: IC4.21(PA11)
MIC_ENV: IC4.10(PA3)
MIC_SIG: IC4.14(PA7)
NRST: C22.1 IC4.4(NRST) J2.2 TP23.1
RCC_OSC_IN: IC4.2(PF0/OSC_IN) Y3.3(XTAL_2)
RCC_OSC_OUT: IC4.3(PF1/OSC_OUT) Y3.1(XTAL_1)
SPI3_MISO: IC4.27(PB4)
SPI3_MOSI: IC4.28(PB5)
SPI3_SCLK: IC4.26(PB3)
SYS_SWCLK_ALT: IC4.24(PA14) J2.1 TP19.1
SYS_SWDIO_ALT: IC4.23(PA13) J2.3 TP21.1
TP_AFE_OUT: IC4.7(PA0)
TP_NOSE: J1.10 TP9.1
TP_NOSE_GND: J1.12 TP8.1  [project net CMOUT]
TP_NOSE_THERM: IC4.8(PA1) J1.9
TP_SS: IC4.13(PA6)
TP_THERMISTOR: IC4.15(PB0)
VBAT_1: J1.13
VBAT_MUX: J1.16 TP7.1
NetIC4_18: IC4.18(PA8) TP25.1
NetIC4_19: IC4.19(PA9) TP24.1
NetIC4_20: IC4.20(PA10) TP22.1
NetIC4_22: IC4.22(PA12) TP20.1

Not connected (* = marked no-connect by the designer): IC4 29(PB6); J1 11 14 15; Y3 2(NC_1) 4(NC_2)

### Notes on the sheet
- I2C PULLUP (DEPOP -- PULLUPS ON MCU BOARD FOR MASTER MCU)
- (near R11) DEPOP
- (near R12) DEPOP
- MICROCONTROLLER
- PATRICK CHWALEK

### Library data of the parts
C21 C22 C24 = GCM155R71C104KA55D: as C1 on sheet Sch_pwr_sys; Datasheets: http://www.murata.com/~/media/webrenewal/support/library/catalog/products/capacitor/mlcc/c03e.ashx; Image: //media.digikey.com/Renders/Murata%20Renders/ZRB-SERIES-0402.jpg; Digi-Key Part Number: 490-4759-1-ND; Part Number: GCM155R71C104KA55D; Quantity Available: 734194; @ qty: 0; Packaging: Cut Tape (CT); Series: GCM; Part Status: Active; Value: 0.10µF; Voltage: 16V; Temperature Coefficient: X7R; Operating Temperature: -55°C ~ 125°C; Features: -; Ratings: AEC-Q200; Applications: Automotive; Mounting Type: Surface Mount, MLCC; Package / Case: 0402 (1005 Metric); Size / Dimension: 0.039" L x 0.020" W (1.00mm x 0.50mm); Height - Seated (Max): -; Thickness (Max): 0.022" (0.55mm); Lead Spacing: -; Lead Style: -
C23 = GRM153R60G475ME15D: as C6 on sheet Sch_pwr_sys; Datasheets: http://psearch.en.murata.com/capacitor/product/GRM153R60G475ME15%23.pdf; Image: //media.digikey.com/Renders/Murata%20Renders/ZRB-SERIES-0402.jpg; Digi-Key Part Number: 490-13231-1-ND; Part Number: GRM153R60G475ME15D; Quantity Available: 9100; @ qty: 0; Packaging: Cut Tape (CT); Series: GRM; Part Status: Active; Value: 4.7µF; Voltage: 4V; Temperature Coefficient: X5R; Operating Temperature: -55°C ~ 85°C; Features: -; Ratings: -; Applications: General Purpose; Mounting Type: Surface Mount, MLCC; Package / Case: 0402 (1005 Metric); Size / Dimension: 0.039" L x 0.020" W (1.00mm x 0.50mm); Height - Seated (Max): -; Thickness (Max): 0.013" (0.33mm); Lead Spacing: -; Lead Style: -
C25 = GCM155R71H103KA55D: as C8 on sheet sch_sensors; Datasheets: http://www.murata.com/~/media/webrenewal/support/library/catalog/products/capacitor/mlcc/c03e.ashx; Image: //media.digikey.com/Renders/Murata%20Renders/ZRB-SERIES-0402.jpg; Digi-Key Part Number: 490-4762-1-ND; Part Number: GCM155R71H103KA55D; Quantity Available: 650067; @ qty: 0; Packaging: Cut Tape (CT); Series: GCM; Part Status: Active; Value: 10000pF; Voltage: 50V; Temperature Coefficient: X7R; Operating Temperature: -55°C ~ 125°C; Features: -; Ratings: AEC-Q200; Applications: Automotive; Mounting Type: Surface Mount, MLCC; Package / Case: 0402 (1005 Metric); Size / Dimension: 0.039" L x 0.020" W (1.00mm x 0.50mm); Height - Seated (Max): -; Thickness (Max): 0.022" (0.55mm); Lead Spacing: -; Lead Style: -
C26 = GCM155C71A105KE38D: as C3 on sheet Sch_pwr_sys; Datasheets: http://www.murata.com/~/media/webrenewal/support/library/catalog/products/capacitor/mlcc/c03e.ashx; Image: //media.digikey.com/Renders/Murata%20Renders/ZRB-SERIES-0402.jpg; Digi-Key Part Number: 490-13409-1-ND; Part Number: GCM155C71A105KE38D; Quantity Available: 7240; @ qty: 0; Packaging: Cut Tape (CT); Series: GCM; Part Status: Active; Value: 1µF; Voltage: 10V; Temperature Coefficient: X7S; Operating Temperature: -55°C ~ 125°C; Features: -; Ratings: AEC-Q200; Applications: Automotive; Mounting Type: Surface Mount, MLCC; Package / Case: 0402 (1005 Metric); Size / Dimension: 0.039" L x 0.020" W (1.00mm x 0.50mm); Height - Seated (Max): -; Thickness (Max): 0.022" (0.55mm); Lead Spacing: -; Lead Style: -
IC4 = STM32F301K6U6: Integrated Circuit; Manufacturer_Name: STMicroelectronics; Datasheet Link: http://www.mouser.com/ds/2/389/stm32f301c6-956213.pdf; Height: 0.6mm; Manufacturer_Part_Number: STM32F301K6U6; Mouser Part Number: 511-STM32F301K6U6; Mouser Price/Stock: https://www.mouser.com/Search/Refine.aspx?Keyword=511-STM32F301K6U6
J1 = 54722-0164: Connector; Manufacturer_Name: Molex; Datasheet Link: http://www.molex.com/webdocs/datasheets/pdf/en-us//0547220164_PCB_RECEPTACLES.pdf; Manufacturer_Part_Number: 54722-0164; Mouser Part Number: 538-54722-0164; Mouser Price/Stock: https://www.mouser.com/Search/Refine.aspx?Keyword=538-54722-0164; RS Part Number: 7206511; RS Price/Stock: https://uk.rs-online.com/web/p/products/7206511
J2 = TC2030-CTX-NL: Connector; Manufacturer_Name: Tag Connect; Datasheet Link: http://www.tag-connect.com/Materials/TC2030-CTX.pdf; Height: 18mm; Manufacturer_Part_Number: TC2030-CTX-NL
R11-R13 = ERJ-2GEJ103X: as R9 on sheet sch_sensors; Part Number: ERJ-2GEJ103X; Datasheets: http://industrial.panasonic.com/www-cgi/jvcr13pz.cgi?E+PZ+3+AOA0001+ERJ2GEJ103X+7+WW; Image: //media.digikey.com/Photos/Panasonic%20Photos/ERJ-PA2-Series.jpg; Digi-Key Part Number: P10KJCT-ND; Quantity Available: 2560215; Packaging: Cut Tape (CT); Series: ERJ; Part Status: Active; Value: 10k; Tolerance: ±5%; Composition: Thick Film; Features: Automotive AEC-Q200; Operating Temperature: -55°C ~ 155°C; Package / Case: 0402 (1005 Metric); Supplier Device Package: 0402; Size / Dimension: 0.039" L x 0.020" W (1.00mm x 0.50mm); Height - Seated (Max): 0.016" (0.40mm); Number of Terminations: 2; Failure Rate: -
Y3 = XRCGB32M000F1H01R0: Crystal or Oscillator; Manufacturer_Name: Murata Electronics; Datasheet Link: https://www.murata.com/en-eu/products/productdetail?partno=XRCGB32M000F1H01R0; Height: 0.7mm; Manufacturer_Part_Number: XRCGB32M000F1H01R0; Mouser Part Number: 81-XRCGB32M000F1H01R; Mouser Price/Stock: https://www.mouser.com/Search/Refine.aspx?Keyword=81-XRCGB32M000F1H01R

## Nets that join several sheets
3.3V_PWR: Sch_pwr_sys (5 pins), sch_sensors (11 pins), Sch_MCU (10 pins)
GND: Sch_pwr_sys (17 pins), sch_sensors (27 pins), Sch_MCU (14 pins)
3.3V_MIC: Sch_pwr_sys (Q2.2), sch_sensors (C27.1 IC6.8 MK1.1 R20.1)
5V: Sch_pwr_sys (C6.1 IC2.1 IC2.2 R4.2), Sch_MCU (J1.4 J2.5)
ANALOG_EXP_CONN: Sch_pwr_sys (CN1.3), Sch_MCU (IC4.9 TP18.1)
CMOUT: sch_sensors (7 pins), Sch_MCU (J1.12 TP8.1)
I2C1_SCL: Sch_pwr_sys (CN1.2), sch_sensors (AC1.19), Sch_MCU (IC4.25 J1.7 R11.1)
I2C1_SDA: Sch_pwr_sys (CN1.4), sch_sensors (AC1.20), Sch_MCU (IC4.30 J1.6 R12.1)
IMU_INT: sch_sensors (AC1.14), Sch_MCU (IC4.12 J1.8 TP10.1)
LH_DIODE_ARRAY: sch_sensors (D1.1), Sch_MCU (J1.3 TP6.1)
MIC_EN: Sch_pwr_sys (Q2.1 R8.2), Sch_MCU (IC4.21)
MIC_ENV: sch_sensors (C30.1 D2.1 R19.1 R21.1), Sch_MCU (IC4.10)
MIC_SIG: sch_sensors (C29.1 IC6.1 R17.1), Sch_MCU (IC4.14)
SPI3_MOSI: sch_sensors (IC3.12), Sch_MCU (IC4.28)
SPI3_SCLK: sch_sensors (IC3.11), Sch_MCU (IC4.26)
TP_AFE_OUT: sch_sensors (C13.1 R6.2), Sch_MCU (IC4.7)
TP_NOSE: sch_sensors (C8.2 IC3.1), Sch_MCU (J1.10 TP9.1)
TP_SS: sch_sensors (IC3.10), Sch_MCU (IC4.13)
TP_THERMISTOR: sch_sensors (R14.2 U1.3), Sch_MCU (IC4.15)
VBAT_1: Sch_pwr_sys (C1.1 PS1.8 TP4.1), Sch_MCU (J1.13)
VBAT_MUX: Sch_pwr_sys (C3.1 IC5.1 PS1.7 R2.1), Sch_MCU (J1.16 TP7.1)